# Altium schematic sheet PSU.SchDoc
size A4
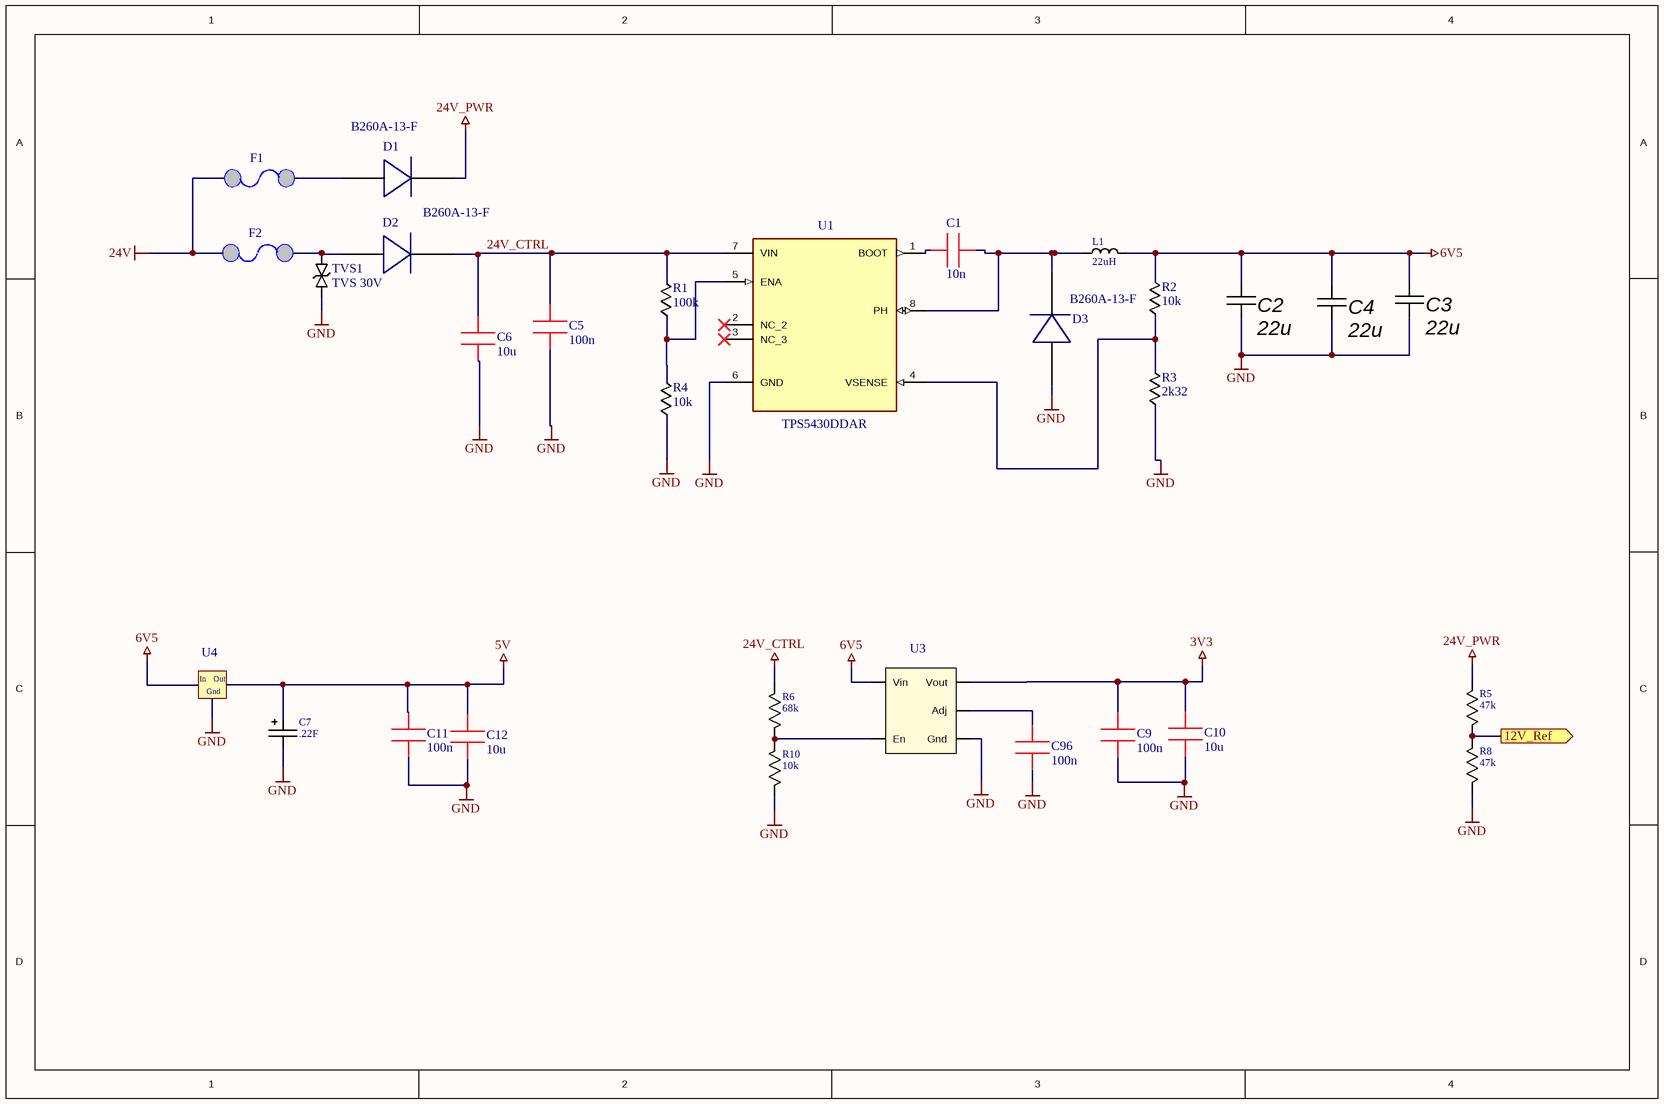
[diagram p0: PSU.SchDoc]

## Parts
C1  10n  [0603]
C2  22u  [0805]
C3  22u  [0805]
C4  22u  [0805]
C5  100n  [0603]
C6  10u  [1210]
C7  .22F  [Supercap -D20-V]
C9  100n  [0603]
C10  10u  [0603]
C11  100n  [0603]
C12  10u  [0603]
C96  100n  [0603]
D1  B260A-13-F  [DO-214Pol]
D2  B260A-13-F  [DO-214Pol]
D3  B260A-13-F  [DO-214Pol]
F1  Resettable FUSE  [1812]  (value not drawn)
F2  Resettable FUSE  [1812]  (value not drawn)
L1  22uH  [CDRH127]
R1  100k  [0603]
R2  10k  [0603]
R3  2k32  [0603]
R4  10k  [0603]
R5  47k  [RES 0603]
R6  68k  [RES 0603]
R8  47k  [RES 0603]
R10  10k  [RES 0603]
TVS1  TVS 30V  [DO-214AC]
U1  TPS5430DDAR  [SOIC-8 + Thermal Pad]
U3  LDO with Enable Pin  [SOT-23-5]  (value not drawn)
U4  LDO 5V  [SOT223]  (value not drawn)

## Ports
12V_Ref

## Nets
3V3: C9.1 C10.1 U3.5(Vout)
5V: C7.2 C11.1 C12.1 U4.2(OUT)
6V5: C2.2 C3.2 C4.2 L1.2 R2.2 U3.1(Vin) U4.3(IN)
24V: F1.2 F2.2
24V_CTRL: C5.2 C6.1 D2.1 R1.2 R6.1 U1.7(VIN)
24V_PWR: D1.1 R5.1
GND: C2.1 C3.1 C4.1 C5.1 C6.2 C7.1 C9.2 C10.2 C11.2 C12.2 C96.2 D3.2 R3.1 R4.1 R8.2 R10.2 TVS1.2 U1.6(GND) U3.2(Gnd) U4.1(GND)
12V_Ref: R5.2 R8.1 ; port 12V_Ref
NetC1_1: C1.1 D3.1 L1.1 U1.8(PH)
NetC1_2: C1.2 U1.1(BOOT)
NetC96_1: C96.1 U3.4(Adj)
NetD1_2: D1.2 F1.1
NetD2_2: D2.2 F2.1 TVS1.1
NetR1_1: R1.1 R4.2 U1.5(ENA)
NetR2_1: R2.1 R3.2 U1.4(VSENSE)
NetR6_2: R6.2 R10.1 U3.3(En)

Not connected (* = marked no-connect by the designer): U1 2(NC_2)* 3(NC_3)*

## Notes on the sheet
- (in symbol ldo) In; Out; Gnd

## Library data of the parts
C1 = 0603 CAP: CC0603JRX7R9BB103
C2-C4 = Capacitor: CC0805MKX5R6BB226; Value: 100 нФ; Type: Конденсатор ЧИП; Power/Voltage: 50В; Tolerance: 10%; Name: 0805
C5 C9 C11 C96 = 0603 CAP: CC0603KRX7R9BB104
C6 = 1206 Cap: GRM32ER71H106KA12L
C7 = Capacitor Polar: 5R5D10F33V; pin to pad: 1>2 2>1
C10 C12 = 0603 CAP: GRM188R61C106MA73D
F1 F2 = Fuse PTS: MF-MSMF030-2
L1 = Inductor CDRH127: CDRH127/LDNP-220MC; Value: 22uH
R1 = 0603 RES: RC0603FR-07100KL
R2 R4 = 0603 RES: RC0603FR-0710KL
R3 = 0603 RES: RC0603FR-072K32L
R5 R8 = Resistor: RC0603FR-0747KL
R6 = Resistor: RC0603JR-0768KL
R10 = Resistor: RC0603FR-0710KL
TVS1 = TVS: SMAJ30CA
U3 = LM8805: LM8805SF5-3.3
U4 = ldo: LD1117S50CTR